# EasyEDA schematic EASY_EDA_Neurostim.json

## Sheets
1 5V: TITLE: Neurostimulator; REV: 1.0; Date: 2024-08-13; Sheet: 1/1; Drawn By: Alexander Bridzhidi; Company: IAI
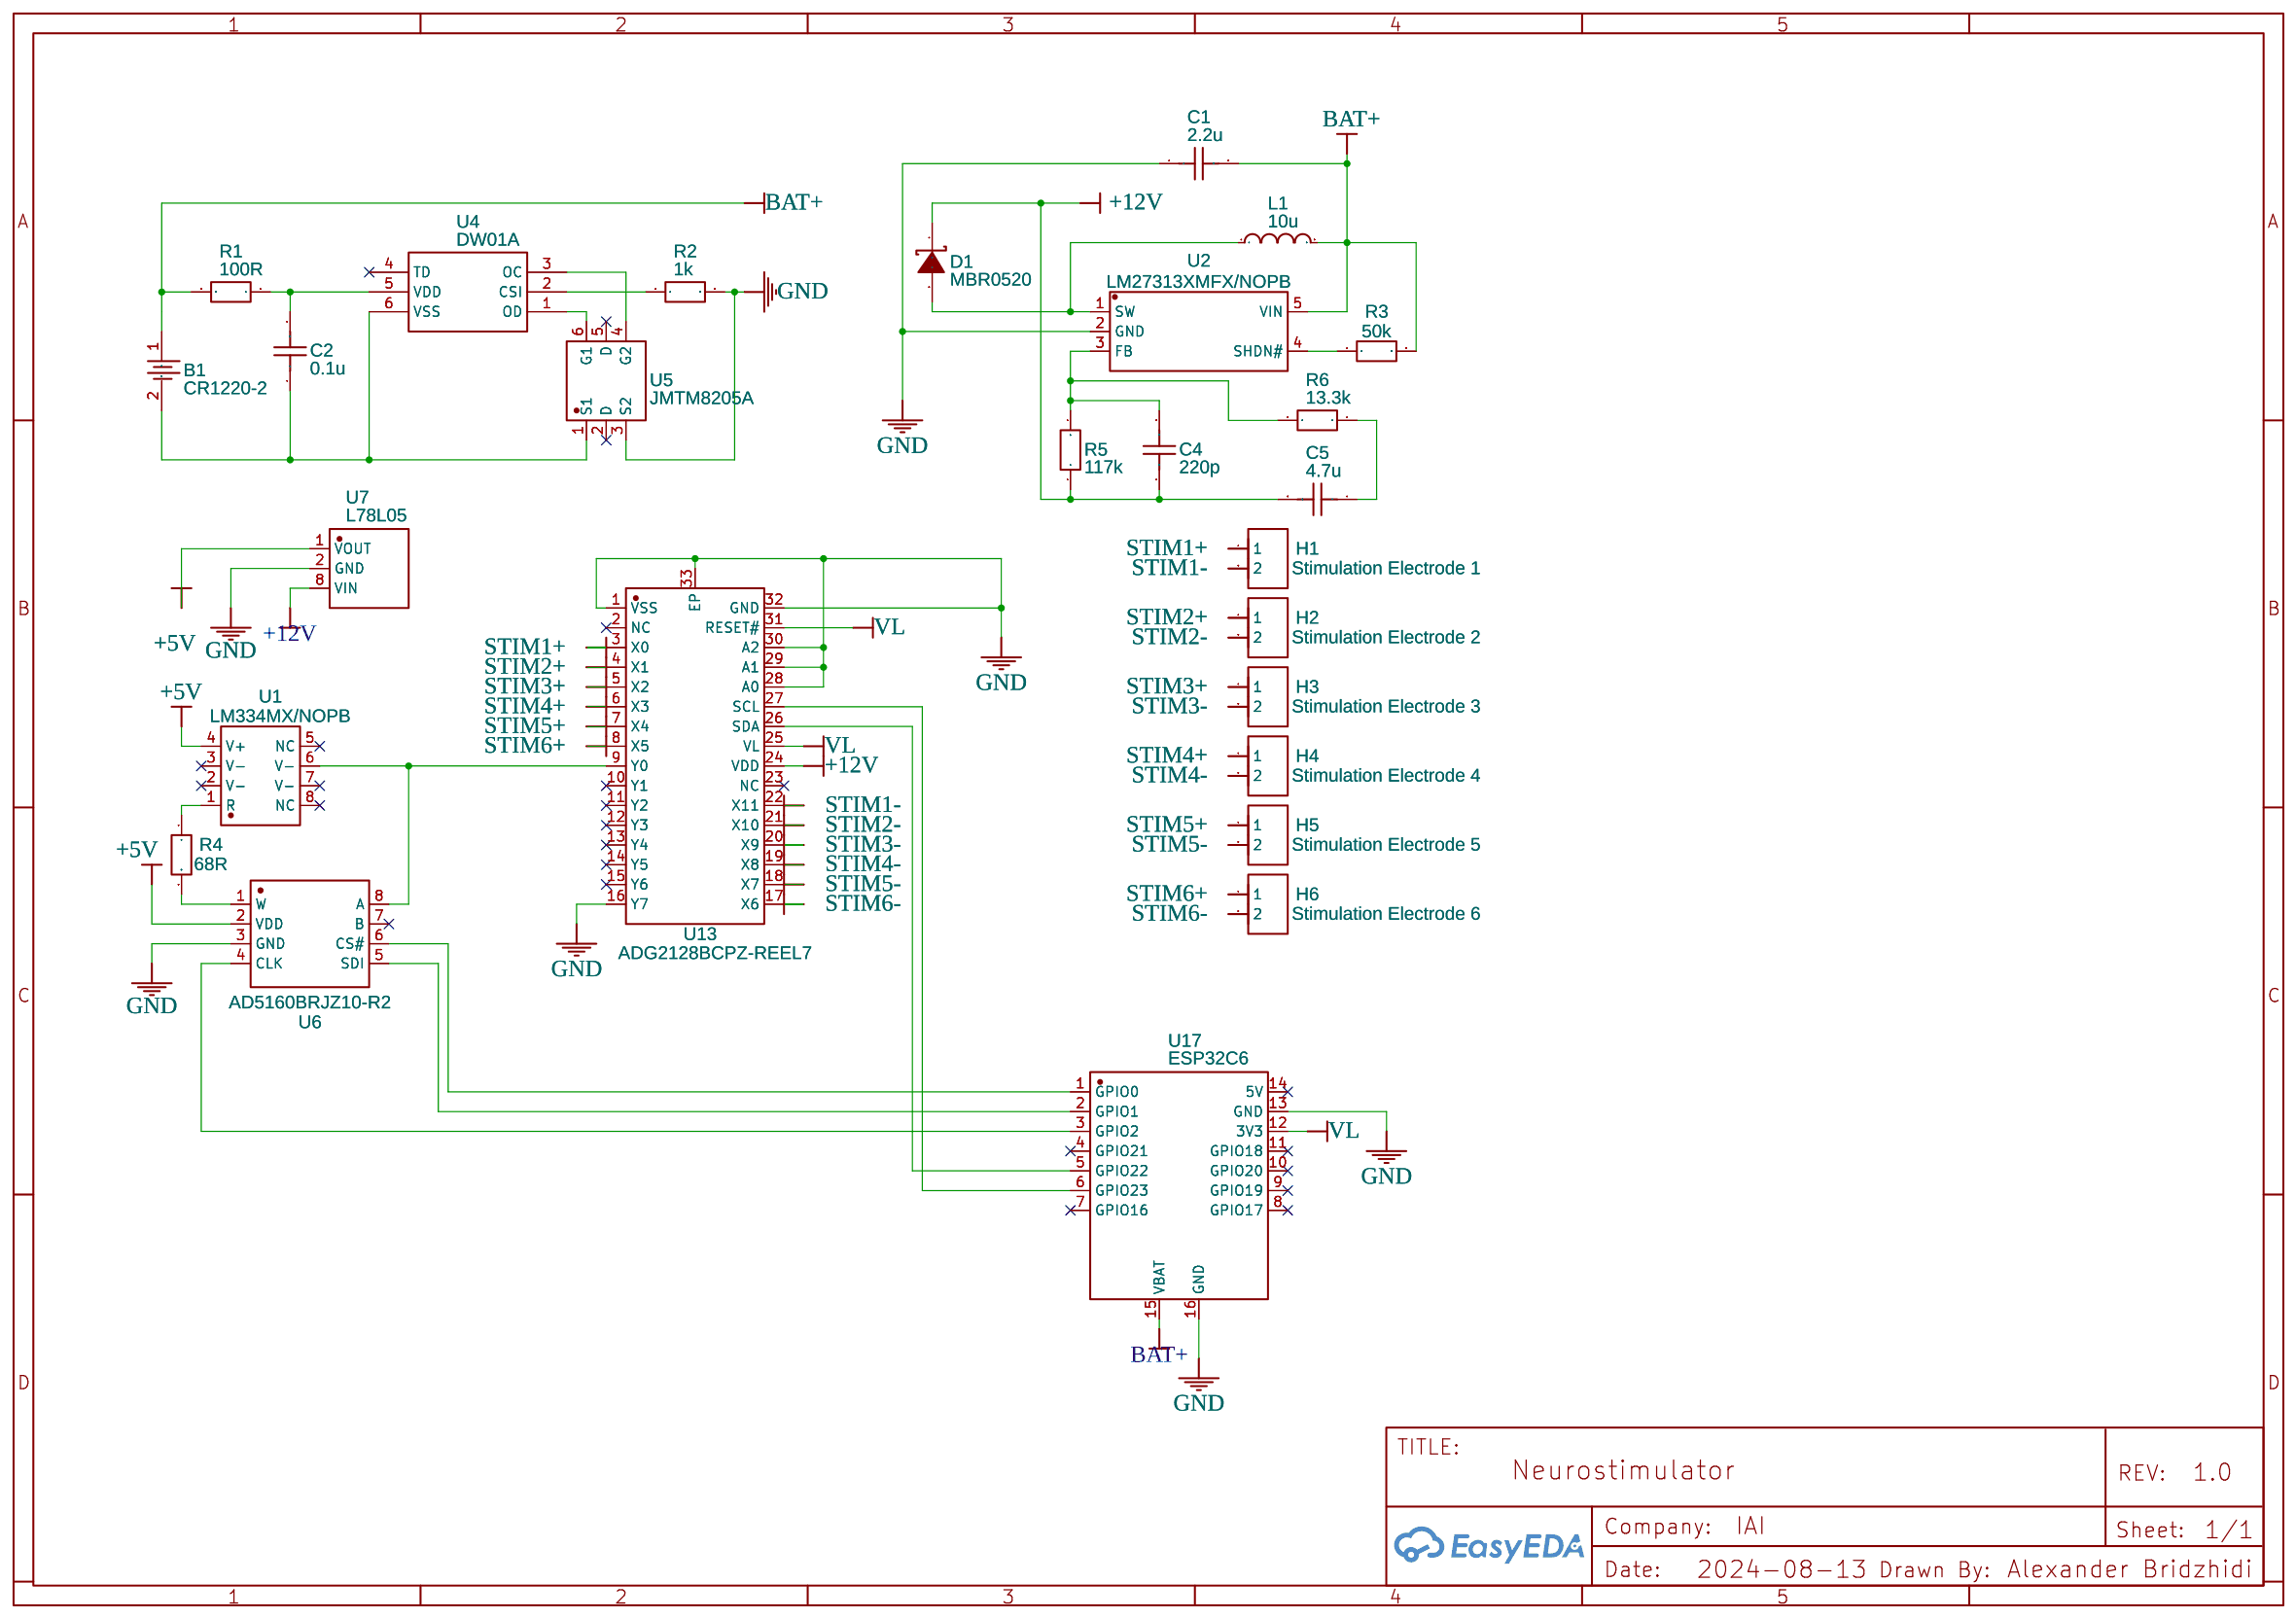
[diagram p0: 5V]
2 12V
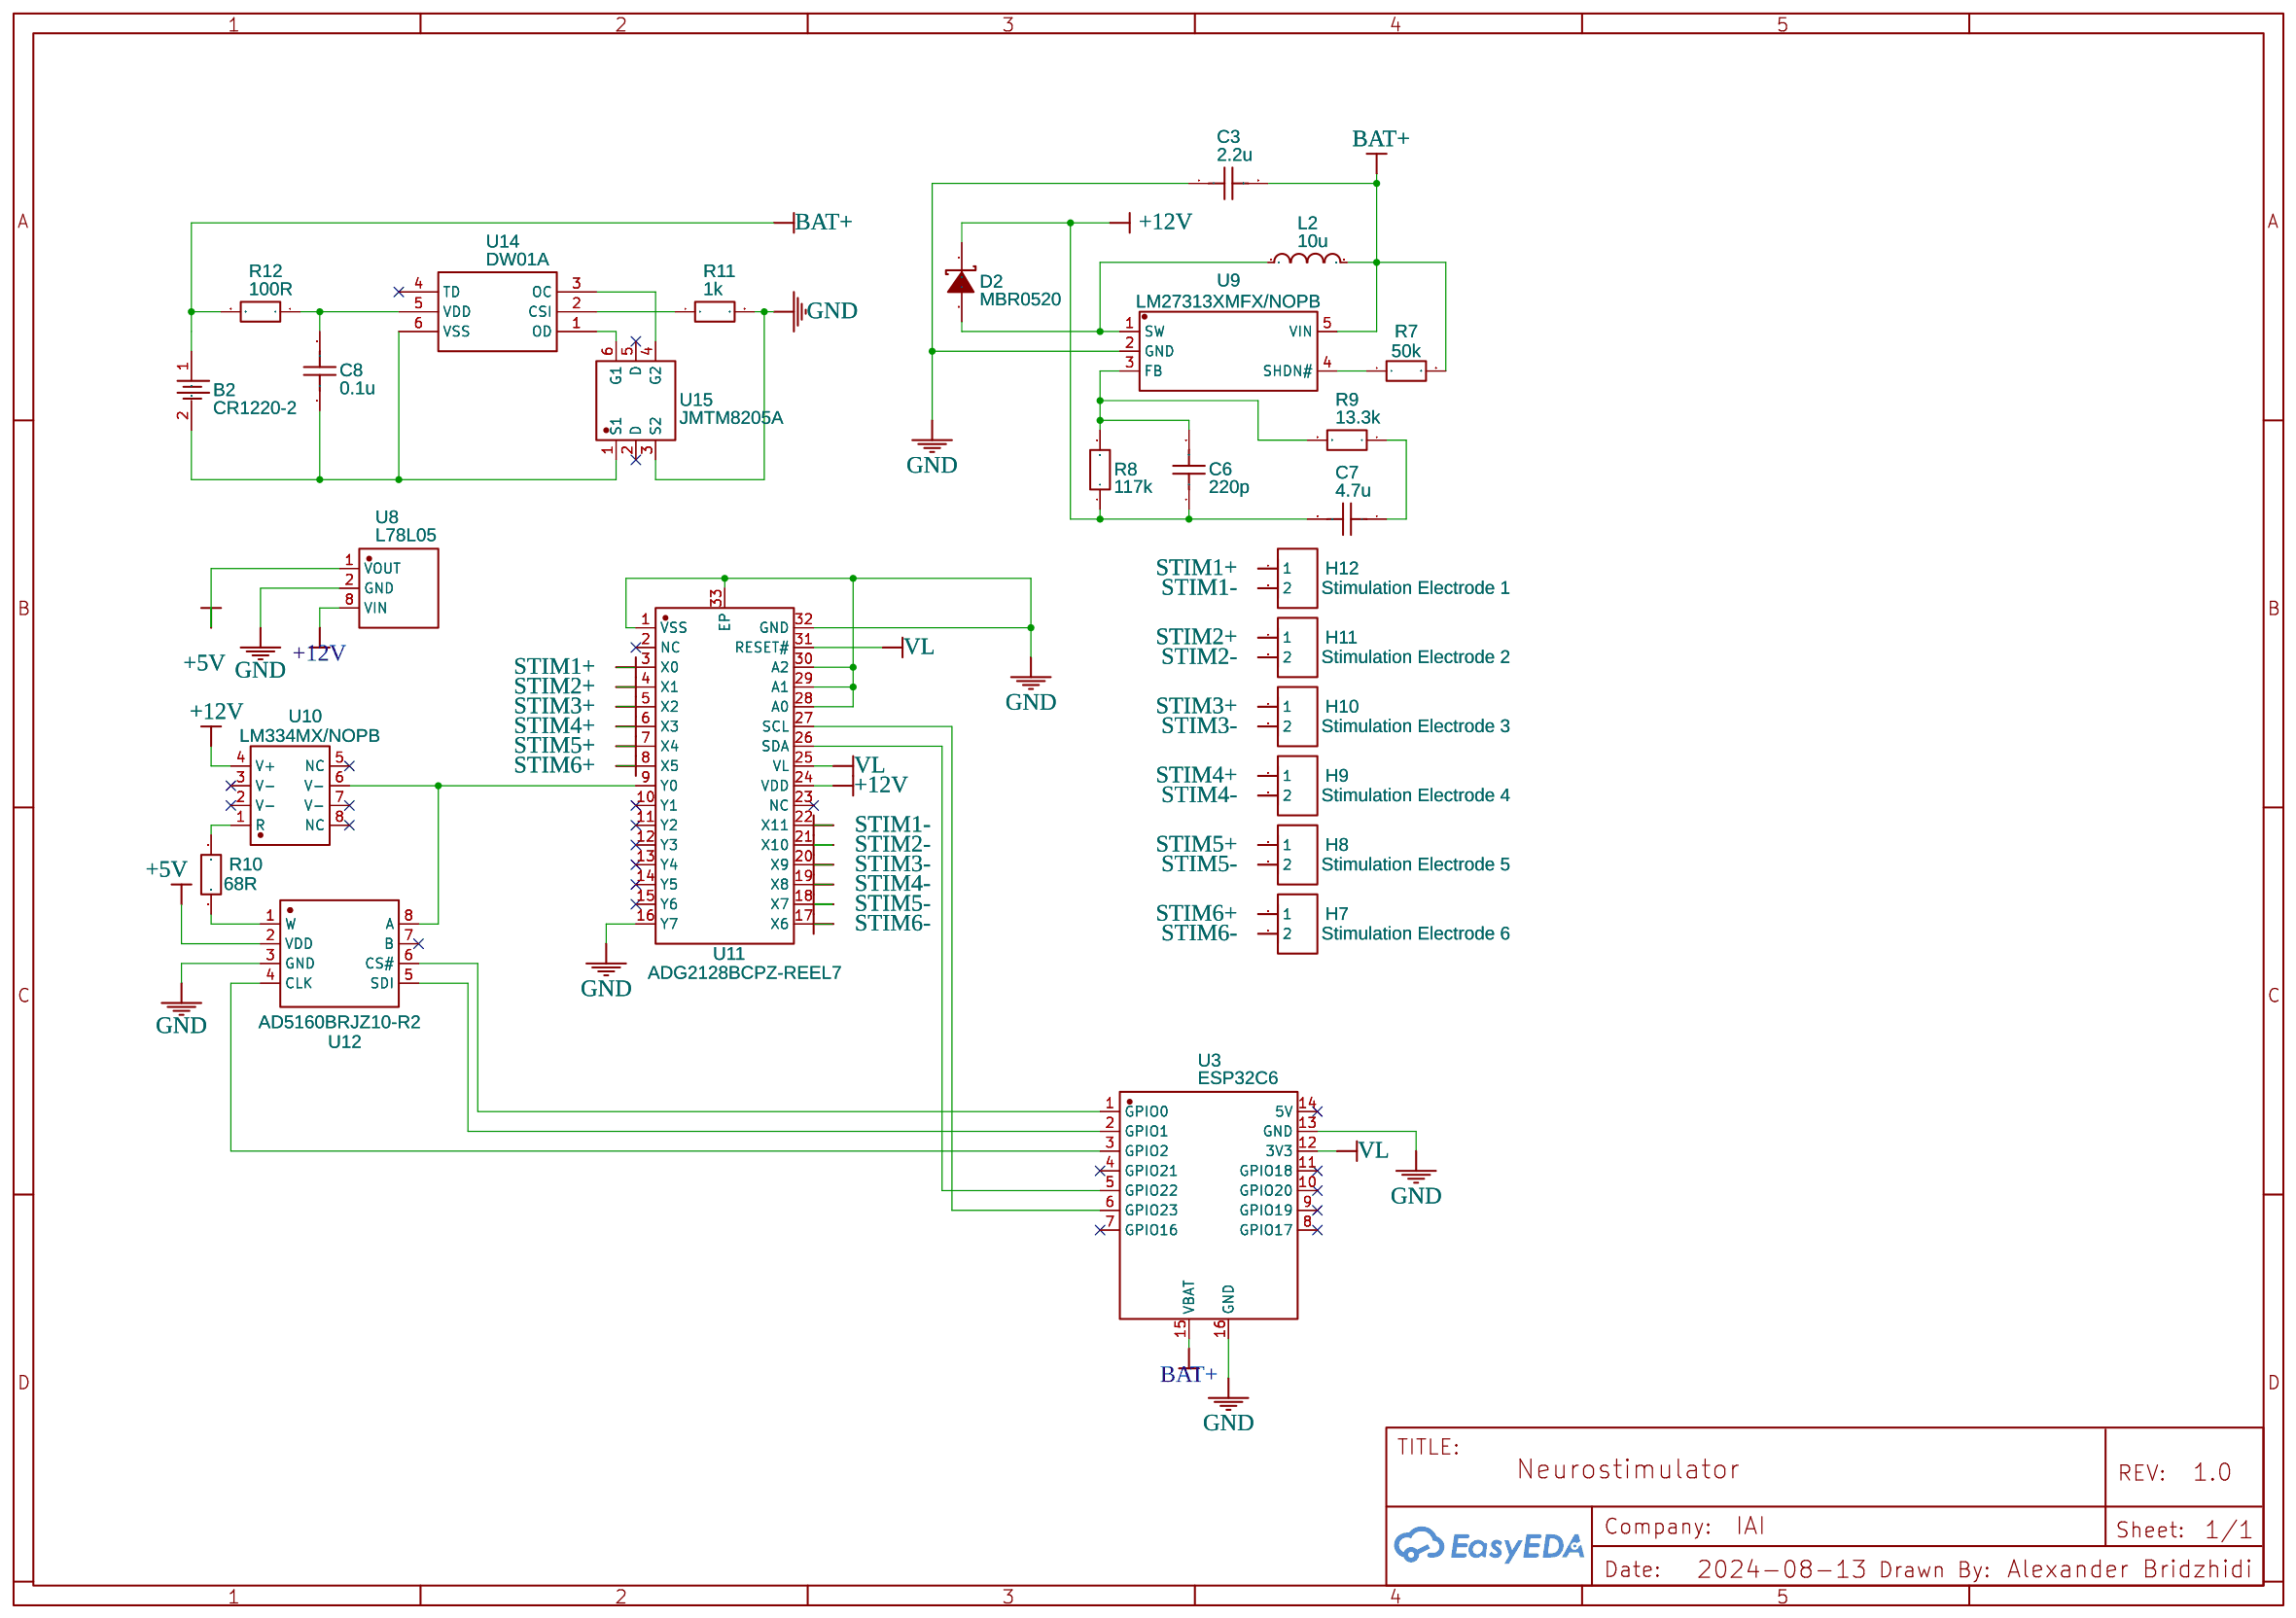
[diagram p1: 12V]

## Parts
sheet 5V
B1  CR1220-2  [BAT-SMD_CR1220-2]
C1  2.2u  [C0603]
C2  0.1u  [C0603]
C4  220p  [C0603]
C5  4.7u  [C0603]
D1  MBR0520  [SOD-123_L2.8-W1.8-LS3.7-RD]
H1  Stimulation Electrode 1  [HDR-F-2.54_1X2]
H2  Stimulation Electrode 2  [HDR-F-2.54_1X2]
H3  Stimulation Electrode 3  [HDR-F-2.54_1X2]
H4  Stimulation Electrode 4  [HDR-F-2.54_1X2]
H5  Stimulation Electrode 5  [HDR-F-2.54_1X2]
H6  Stimulation Electrode 6  [HDR-F-2.54_1X2]
L1  10u  [L0603]
R1  100R  [R0603]
R2  1k  [R0603]
R3  50k  [R0603]
R4  68R  [R0805]
R5  117k  [R0603]
R6  13.3k  [R0603]
U1  LM334MX/NOPB  [SOIC-8_L5.0-W4.0-P1.27-LS6.0-BL]
U2  LM27313XMFX/NOPB  [SOT-23-5_L3.0-W1.7-P0.95-LS2.8-BR]
U4  DW01A  [SOT-23-6_L2.9-W1.6-P0.95-LS2.8-BL]
U5  JMTM8205A  [SOT-23-6_L2.9-W1.6-P0.95-LS2.9-BL]
U6  AD5160BRJZ10-R2  [SOT-23-8_L3.0-W1.7-P0.65-LS2.8-TL]
U7  L78L05  [SOIC-8_L4.9-W3.9-P1.27-LS6.0-TL-EP]
U13  ADG2128BCPZ-REEL7  [LFCSP-32_L5.0-W5.0-P0.50-BL-EP3.1]
U17  ESP32C6  [XIAO_ESP32C6]
sheet 12V
B2  CR1220-2  [BAT-SMD_CR1220-2]
C3  2.2u  [C0603]
C6  220p  [C0603]
C7  4.7u  [C0603]
C8  0.1u  [C0603]
D2  MBR0520  [SOD-123_L2.8-W1.8-LS3.7-RD]
H7  Stimulation Electrode 6  [HDR-F-2.54_1X2]
H8  Stimulation Electrode 5  [HDR-F-2.54_1X2]
H9  Stimulation Electrode 4  [HDR-F-2.54_1X2]
H10  Stimulation Electrode 3  [HDR-F-2.54_1X2]
H11  Stimulation Electrode 2  [HDR-F-2.54_1X2]
H12  Stimulation Electrode 1  [HDR-F-2.54_1X2]
L2  10u  [L0603]
R7  50k  [R0603]
R8  117k  [R0603]
R9  13.3k  [R0603]
R10  68R  [R0805]
R11  1k  [R0603]
R12  100R  [R0603]
U3  ESP32C6  [XIAO_ESP32C6]
U8  L78L05  [SOIC-8_L4.9-W3.9-P1.27-LS6.0-TL-EP]
U9  LM27313XMFX/NOPB  [SOT-23-5_L3.0-W1.7-P0.95-LS2.8-BR]
U10  LM334MX/NOPB  [SOIC-8_L5.0-W4.0-P1.27-LS6.0-BL]
U11  ADG2128BCPZ-REEL7  [LFCSP-32_L5.0-W5.0-P0.50-BL-EP3.1]
U12  AD5160BRJZ10-R2  [SOT-23-8_L3.0-W1.7-P0.65-LS2.8-TL]
U14  DW01A  [SOT-23-6_L2.9-W1.6-P0.95-LS2.8-BL]
U15  JMTM8205A  [SOT-23-6_L2.9-W1.6-P0.95-LS2.9-BL]

## Library data of the parts
B1 B2 = CR1220-2: Supplier: LCSC; Manufacturer: Q&J; image: //image.lceda.cn/szlcsc/C70381.jpg; Supplier Part: C70381
C1-C8 = C_0603_US: Contributor: LCEDA_Lib
D1 D2 = MBR0520: Supplier: LCSC; Manufacturer: CJ(江苏长电/长晶); Supplier Part: C77335; JLCPCB Part Class: Extended Part
H1-H12 = HDR-F-2.54_1x2: Supplier Part: C49661; Supplier: LCSC; Contributor: LCEDA_Lib
L1 L2 = L0603_US: Contributor: LCEDA_Lib
R1-R3 R5-R9 R11 R12 = R_0603_EU: Contributor: LCEDA_Lib
R4 R10 = R_0805_EU: Contributor: LCEDA_Lib
U1 U10 = LM334MX/NOPB: Supplier: LCSC; Manufacturer: TI(德州仪器); Supplier Part: C7945; JLCPCB Part Class: Extended Part
U2 U9 = LM27313XMFX/NOPB: Contributor: LCSC; Supplier: LCSC; Supplier Part: C341750; Manufacturer: TI(德州仪器); JLCPCB Part Class: Extended Part
U4 U14 = DW01A: Supplier: LCSC; Manufacturer: null; Supplier Part: C85680; JLCPCB Part Class: Extended Part
U5 U15 = JMTM8205A: Contributor: lcsc; Supplier: LCSC; Supplier Part: C5173657; Manufacturer: JJW(捷捷微)
U6 U12 = AD5160BRJZ10-R2: Contributor: LCSC; Supplier: LCSC; Manufacturer: ADI(亚德诺); Supplier Part: C143914; JLCPCB Part Class: Extended Part
U7 U8 = L78L05ACZ-AP: Contributor: LCSC; Supplier: LCSC; Supplier Part: C495222; Manufacturer: ST(意法半导体); JLCPCB Part Class: Extended Part
U11 U13 = ADG2128BCPZ-REEL7: Contributor: LCSC; Supplier: LCSC; Supplier Part: C579041; Manufacturer: ADI(亚德诺); JLCPCB Part Class: Extended Part
U3 U17 = ESP32C6: Contributor: losli

## Nets
+5V: U1.4(V+) U6.2(VDD) U7.1(VOUT) U8.1(VOUT) U12.2(VDD)
+12V: C4.1 C5.2 C6.1 C7.2 D1.1(K) D2.1(K) R5.1 R8.1 U7.8(VIN) U8.8(VIN) U10.4(V+) U11.24(VDD) U13.24(VDD)
GND: C1.1 C3.1 R2.2 R11.2 U2.2(GND) U3.13(GND) U3.16(GND) U5.3(S2) U6.3(GND) U7.2(GND) U8.2(GND) U9.2(GND) U11.1(VSS) U11.16(Y7) U11.28(A0) U11.29(A1) U11.30(A2) U11.32(GND) U11.33(EP) U12.3(GND) U13.1(VSS) U13.16(Y7) U13.28(A0) U13.29(A1) U13.30(A2) U13.32(GND) U13.33(EP) U15.3(S2) U17.13(GND) U17.16(GND)
BAT+: B1.1 B2.1 C1.2 C3.2 L1.2 L2.2 R1.2 R3.2 R7.2 R12.2 U2.5(VIN) U3.15(VBAT) U9.5(VIN) U17.15(VBAT)
STIM1+: H1.1 H12.1 U11.3(X0) U13.3(X0)
STIM1-: H1.2 H12.2 U11.22(X11) U13.22(X11)
STIM2+: H2.1 H11.1 U11.4(X1) U13.4(X1)
STIM2-: H2.2 H11.2 U11.21(X10) U13.21(X10)
STIM3+: H3.1 H10.1 U11.5(X2) U13.5(X2)
STIM3-: H3.2 H10.2 U11.20(X9) U13.20(X9)
STIM4+: H4.1 H9.1 U11.6(X3) U13.6(X3)
STIM4-: H4.2 H9.2 U11.19(X8) U13.19(X8)
STIM5+: H5.1 H8.1 U11.7(X4) U13.7(X4)
STIM5-: H5.2 H8.2 U11.18(X7) U13.18(X7)
STIM6+: H6.1 H7.1 U11.8(X5) U13.8(X5)
STIM6-: H6.2 H7.2 U11.17(X6) U13.17(X6)
VL: U3.12(3V3) U11.25(VL) U11.31(RESET#) U13.25(VL) U13.31(RESET#) U17.12(3V3)
Net-(B1-2): B1.2 C2.1 U4.6(VSS) U5.1(S1)
Net-(B2-2): B2.2 C8.1 U14.6(VSS) U15.1(S1)
Net-(C2-2): C2.2 R1.1 U4.5(VDD)
Net-(C4-2): C4.2 R5.2 R6.2 U2.3(FB)
Net-(C5-1): C5.1 R6.1
Net-(C6-2): C6.2 R8.2 R9.2 U9.3(FB)
Net-(C7-1): C7.1 R9.1
Net-(C8-2): C8.2 R12.1 U14.5(VDD)
Net-(D1-2): D1.2(A) L1.1 U2.1(SW)
Net-(D2-2): D2.2(A) L2.1 U9.1(SW)
Net-(R2-1): R2.1 U4.2(CSI)
Net-(R3-1): R3.1 U2.4(SHDN#)
Net-(R4-1): R4.1 U1.1(R)
Net-(R4-2): R4.2 U6.1(W)
Net-(R7-1): R7.1 U9.4(SHDN#)
Net-(R10-1): R10.1 U10.1(R)
Net-(R10-2): R10.2 U12.1(W)
Net-(R11-1): R11.1 U14.2(CSI)
Net-(U1-6): U1.6(V-) U6.8(A) U13.9(Y0)
Net-(U3-1): U3.1(GPIO0) U12.6(CS#)
Net-(U3-2): U3.2(GPIO1) U12.5(SDI)
Net-(U3-3): U3.3(GPIO2) U12.4(CLK)
Net-(U3-5): U3.5(GPIO22) U11.26(SDA)
Net-(U3-6): U3.6(GPIO23) U11.27(SCL)
Net-(U4-1): U4.1(OD) U5.6(G1)
Net-(U4-3): U4.3(OC) U5.4(G2)
Net-(U6-4): U6.4(CLK) U17.3(GPIO2)
Net-(U6-5): U6.5(SDI) U17.2(GPIO1)
Net-(U6-6): U6.6(CS#) U17.1(GPIO0)
Net-(U10-6): U10.6(V-) U11.9(Y0) U12.8(A)
Net-(U13-26): U13.26(SDA) U17.5(GPIO22)
Net-(U13-27): U13.27(SCL) U17.6(GPIO23)
Net-(U14-1): U14.1(OD) U15.6(G1)
Net-(U14-3): U14.3(OC) U15.4(G2)

Not connected (* = marked no-connect by the designer): U1 2(V-)* 3(V-)* 5(NC)* 7(V-)* 8(NC)*; U3 4(GPIO21)* 7(GPIO16)* 8(GPIO17)* 9(GPIO19)* 10(GPIO20)* 11(GPIO18)* 14(5V)*; U4 4(TD)*; U5 2(D)* 5(D)*; U6 7(B)*; U10 2(V-)* 3(V-)* 5(NC)* 7(V-)* 8(NC)*; U11 2(NC)* 10(Y1)* 11(Y2)* 12(Y3)* 13(Y4)* 14(Y5)* 15(Y6)* 23(NC)*; U12 7(B)*; U13 2(NC)* 10(Y1)* 11(Y2)* 12(Y3)* 13(Y4)* 14(Y5)* 15(Y6)* 23(NC)*; U14 4(TD)*; U15 2(D)* 5(D)*; U17 4(GPIO21)* 7(GPIO16)* 8(GPIO17)* 9(GPIO19)* 10(GPIO20)* 11(GPIO18)* 14(5V)*
